# Altium schematic sheet USB_HS_DEVICE.SchDoc
size 420 x 297 mm; SheetNumber: 8; SheetTotal: 9
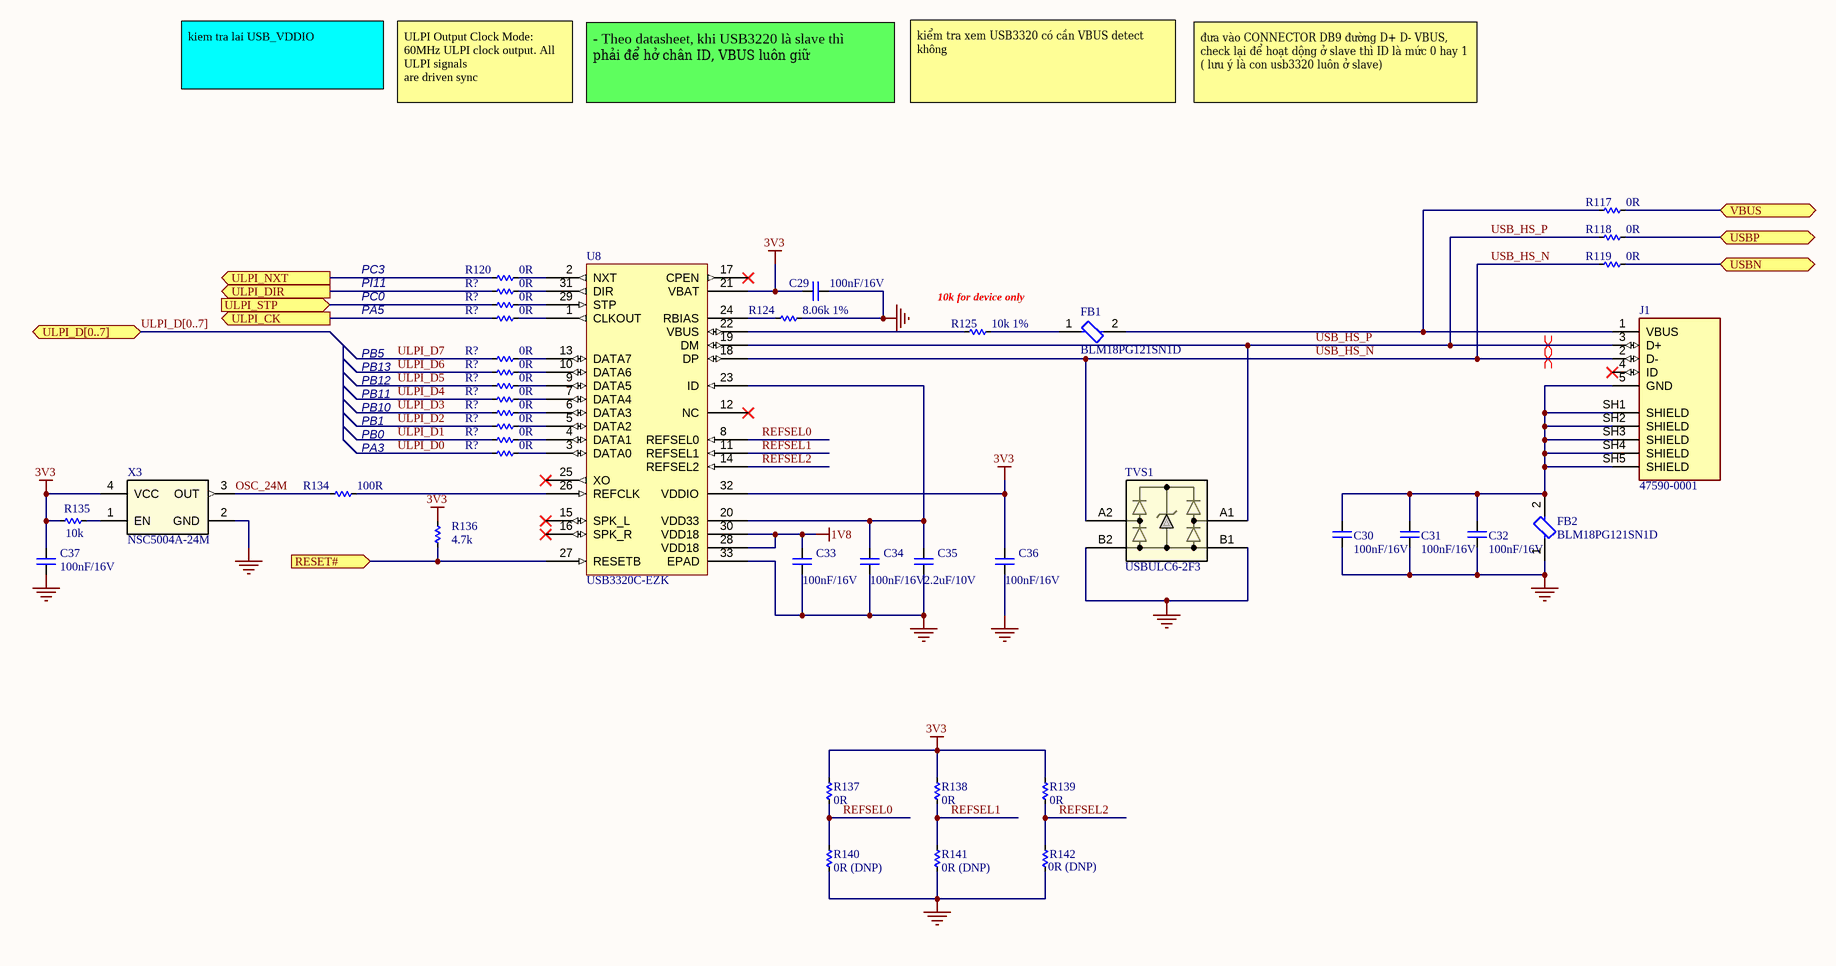
[diagram p0: USB_HS_DEVICE.SchDoc]

## Parts
(Parts that share a designator on the sheet are numbered #1, #2 ... from top to bottom, then left to right.)
C29  100nF/16V  [CAP_C_1608X80]
C30  100nF/16V  [CAP_C_1608X80]
C31  100nF/16V  [CAP_C_1608X80]
C32  100nF/16V  [CAP_C_1608X80]
C33  100nF/16V  [CAP_C_1608X80]
C34  100nF/16V  [CAP_C_1608X80]
C35  2.2uF/10V  [CAP_C_1608X80]
C36  100nF/16V  [CAP_C_1608X80]
C37  100nF/16V  [CAP_C_1608X80]
FB1  BLM18PG121SN1D  [FP-BLM18-0_15-t0_8-IPC_A]
FB2  BLM18PG121SN1D  [FP-BLM18-0_15-t0_8-IPC_A]
J1  47590-0001  [MOLEX_47590-0001]
R117  0R  [RES_C_1608X60]
R118  0R  [RES_C_1608X60]
R119  0R  [RES_C_1608X60]
R120  0R  [RES_C_1608X60]
R124  8.06k 1%  [RES_C_1608X60]
R125  10k 1%  [RES_C_1608X60]
R134  100R  [RES_C_1608X60]
R135  10k  [RES_C_1608X60]
R136  4.7k  [RES_C_1608X60]
R137  0R  [RES_C_1608X60]
R138  0R  [RES_C_1608X60]
R139  0R  [RES_C_1608X60]
R140  0R (DNP)  [RES_C_1608X60]
R141  0R (DNP)  [RES_C_1608X60]
R142  0R (DNP)  [RES_C_1608X60]
R?#1  0R  [RES_C_1608X60]
R?#2  0R  [RES_C_1608X60]
R?#3  0R  [RES_C_1608X60]
R?#4  0R  [RES_C_1608X60]
R?#5  0R  [RES_C_1608X60]
R?#6  0R  [RES_C_1608X60]
R?#7  0R  [RES_C_1608X60]
R?#8  0R  [RES_C_1608X60]
R?#9  0R  [RES_C_1608X60]
R?#10  0R  [RES_C_1608X60]
R?#11  0R  [RES_C_1608X60]
TVS1  USBULC6-2F3  [FLIPCHIP4_USBUL_STM]
U8  USB3320C-EZK  [QFN32_5X5MC_MCH]
X3  NSC5004A-24M  [NSC5004D-25M]

## Ports
RESET# (in), ULPI_CK (out), ULPI_D[0..7] (bidir), ULPI_DIR (out), ULPI_NXT (out), ULPI_STP (in), USBN (bidir), USBP (bidir), VBUS (bidir)

## Nets
1V8: C33.2 U8.28(VDD18) U8.30(VDD18)
3V3: C29.2 C36.2 C37.2 R135.2 R136.1 R137.1 R138.1 R139.1 U8.21(VBAT) U8.32(VDDIO) X3.4(VCC)
GND: C29.1 C30.1 C31.1 C32.1 C33.1 C34.1 C35.1 C36.1 C37.1 FB2.1 R124.2 R140.2 R141.2 R142.2 TVS1.B1 TVS1.B2 U8.33(EPAD) X3.2(GND)
OSC_24M: R134.2 X3.3(OUT)
REFSEL0: R137.2 R140.1 U8.8(REFSEL0)
REFSEL1: R138.2 R141.1 U8.11(REFSEL1)
REFSEL2: R139.2 R142.1 U8.14(REFSEL2)
RESET#: R136.2 U8.27(RESETB) ; port RESET#
ULPI_CK: R?#3.2 ; port ULPI_CK
ULPI_D0: R?#11.2
ULPI_D1: R?#10.2
ULPI_D2: R?#9.2
ULPI_D3: R?#8.2
ULPI_D4: R?#7.2
ULPI_D5: R?#6.2
ULPI_D6: R?#5.2
ULPI_D7: R?#4.2
ULPI_DIR: R?#1.2 ; port ULPI_DIR
ULPI_NXT: R120.2 ; port ULPI_NXT
ULPI_STP: R?#2.2 ; port ULPI_STP
USB_HS_N: J1.2(D-) R119.1 TVS1.A2 U8.18(DP)
USB_HS_P: J1.3(D+) R118.1 TVS1.A1 U8.19(DM)
USBN: R119.2 ; port USBN
USBP: R118.2 ; port USBP
VBUS: R117.2 ; port VBUS
NetC30_2: C30.2 C31.2 C32.2 FB2.2 J1.5(GND) J1.SH1(SHIELD) J1.SH2(SHIELD) J1.SH3(SHIELD) J1.SH4(SHIELD) J1.SH5(SHIELD)
NetC34_2: C34.2 C35.2 U8.20(VDD33) U8.23(ID)
NetFB1_1: FB1.1 R125.2
NetFB1_2: FB1.2 J1.1(VBUS) R117.1
NetR120_1: R120.1 U8.2(NXT)
NetR124_1: R124.1 U8.24(RBIAS)
NetR125_1: R125.1 U8.22(VBUS)
NetR134_1: R134.1 U8.26(REFCLK)
NetR135_1: R135.1 X3.1(EN)
NetR?#1_1: R?#1.1 U8.31(DIR)
NetR?#2_1: R?#2.1 U8.29(STP)
NetR?#3_1: R?#3.1 U8.1(CLKOUT)
NetR?#4_1: R?#4.1 U8.13(DATA7)
NetR?#5_1: R?#5.1 U8.10(DATA6)
NetR?#6_1: R?#6.1 U8.9(DATA5)
NetR?#7_1: R?#7.1 U8.7(DATA4)
NetR?#8_1: R?#8.1 U8.6(DATA3)
NetR?#9_1: R?#9.1 U8.5(DATA2)
NetR?#10_1: R?#10.1 U8.4(DATA1)
NetR?#11_1: R?#11.1 U8.3(DATA0)

Not connected (* = marked no-connect by the designer): J1 4(ID)*; U8 12(NC)* 15(SPK_L)* 16(SPK_R)* 17(CPEN)* 25(XO)*

## Buses and harness runs
bus ULPI_D[0..7] = port ULPI_D[0..7]

## Layout directives
differential pair: USB_HS_N, USB_HS_P

## Notes on the sheet
- kiem tra lai USB_VDDIO
- ULPI Output Clock Mode:
  60MHz ULPI clock output. All ULPI signals
  are driven sync
- - Theo datasheet, khi USB3220 là slave thì phải để hở chân ID, VBUS luôn giữ
- kiểm tra xem USB3320 có cần VBUS detect không
- đưa vào CONNECTOR DB9 đường D+ D- VBUS, check lại để hoạt dộng ở slave thì ID là mức 0 hay 1 ( lưu ý là con usb3320 luôn ở slave)
- PC3
- PI11
- PC0
- PA5
- (near R125) 10k for device only
- PB10
- PB11
- PB12
- PB13
- PB5
- (near R134) PA3
- (near R134) PB0
- PB1
- Sub-system:
- Design by:
- Sheet title:
- Project:
- Sheet:
- of
- Checked by:
- Approved by:
- Doc no:
- Revision:
- Size:
- Date:

## Library data of the parts
C29-C37 = CAP_SMD: CAP_Chip; Value: 33pF
FB1 FB2 = CMP-0686-00557-7: Chip Ferrite Bead, 0603, 120Ω @ 100MHz, 0.05Ω, 25%, 2A; Impedance: 120R; Number of Circuits: 1; Shielding: Unshielded; Material: Steel; DC Resistance (DCR): 50mR; Case Code (Imperial): 0603; RoHS Compliant: Yes; Number of Pins: 2; Min Operating Temperature: -55°C; Case Code (Metric): 1608; Frequency: 100MHz; Length: 1.6mm; Test Frequency: 100MHz; Max Operating Temperature: 125°C; Packaging: Tape and Reel; Max Current Rating: 2A; Termination: SMD/SMT; Lead Free: Lead Free; Max DC Current: 2A; Case/Package: 0603; Height: 0.8mm; Current Rating: 2A; Radiation Hardening: No; Core Material: Ferrite; DC Current: 2A; REACH SVHC: No SVHC; Package Quantity: 1; Depth: 0.8mm; Number of Lines: 1; Tolerance: 25%; Width: 0.8mm
J1 = 47590-0001: RightAngle SMT TypeABVersion 2.0 Micro USB Conn Skt,30Vac,1.8A 47650 MICRO-USB | Molex Incorporated 47590-0001; SnapEDA_Link: https://www.snapeda.com/parts/47590-0001/Molex/view-part/?ref=snap; Package: None; Value: *; MF: Molex; MP: 47590-0001; Check_prices: https://www.snapeda.com/parts/47590-0001/Molex/view-part/?ref=eda
R117-R119 = _RES_B_2: RES, 0603
R120 R124 R125 R134-R142 R?#1-R?#11 = _RES_B_2: RES
TVS1 = USBULC6-2F3: TVS DIODE 3VWM 4FLIPCHIP; Manufacturer_Name: STMicroelectronics; Copyright: Copyright (C) 2025 Ultra Librarian. All rights reserved.; Manufacturer_Part_Number: USBULC6-2F3; RefDes: RefDes; Type: Type
U8 = USB3320C-EZK: IC TRANSCEIVER HALF 1/1 32QFN
X3 = NSC5004D-25M: XTAL OSC XO 24.0000MHZ CMOS SMD; Manufacturer_Name: NDK; Manufacturer_Part_Number: NSC5004A-25M; Type: Oscillators; Copyright: Copyright (C) 2025 Ultra Librarian. All rights reserved.; RefDes: RefDes